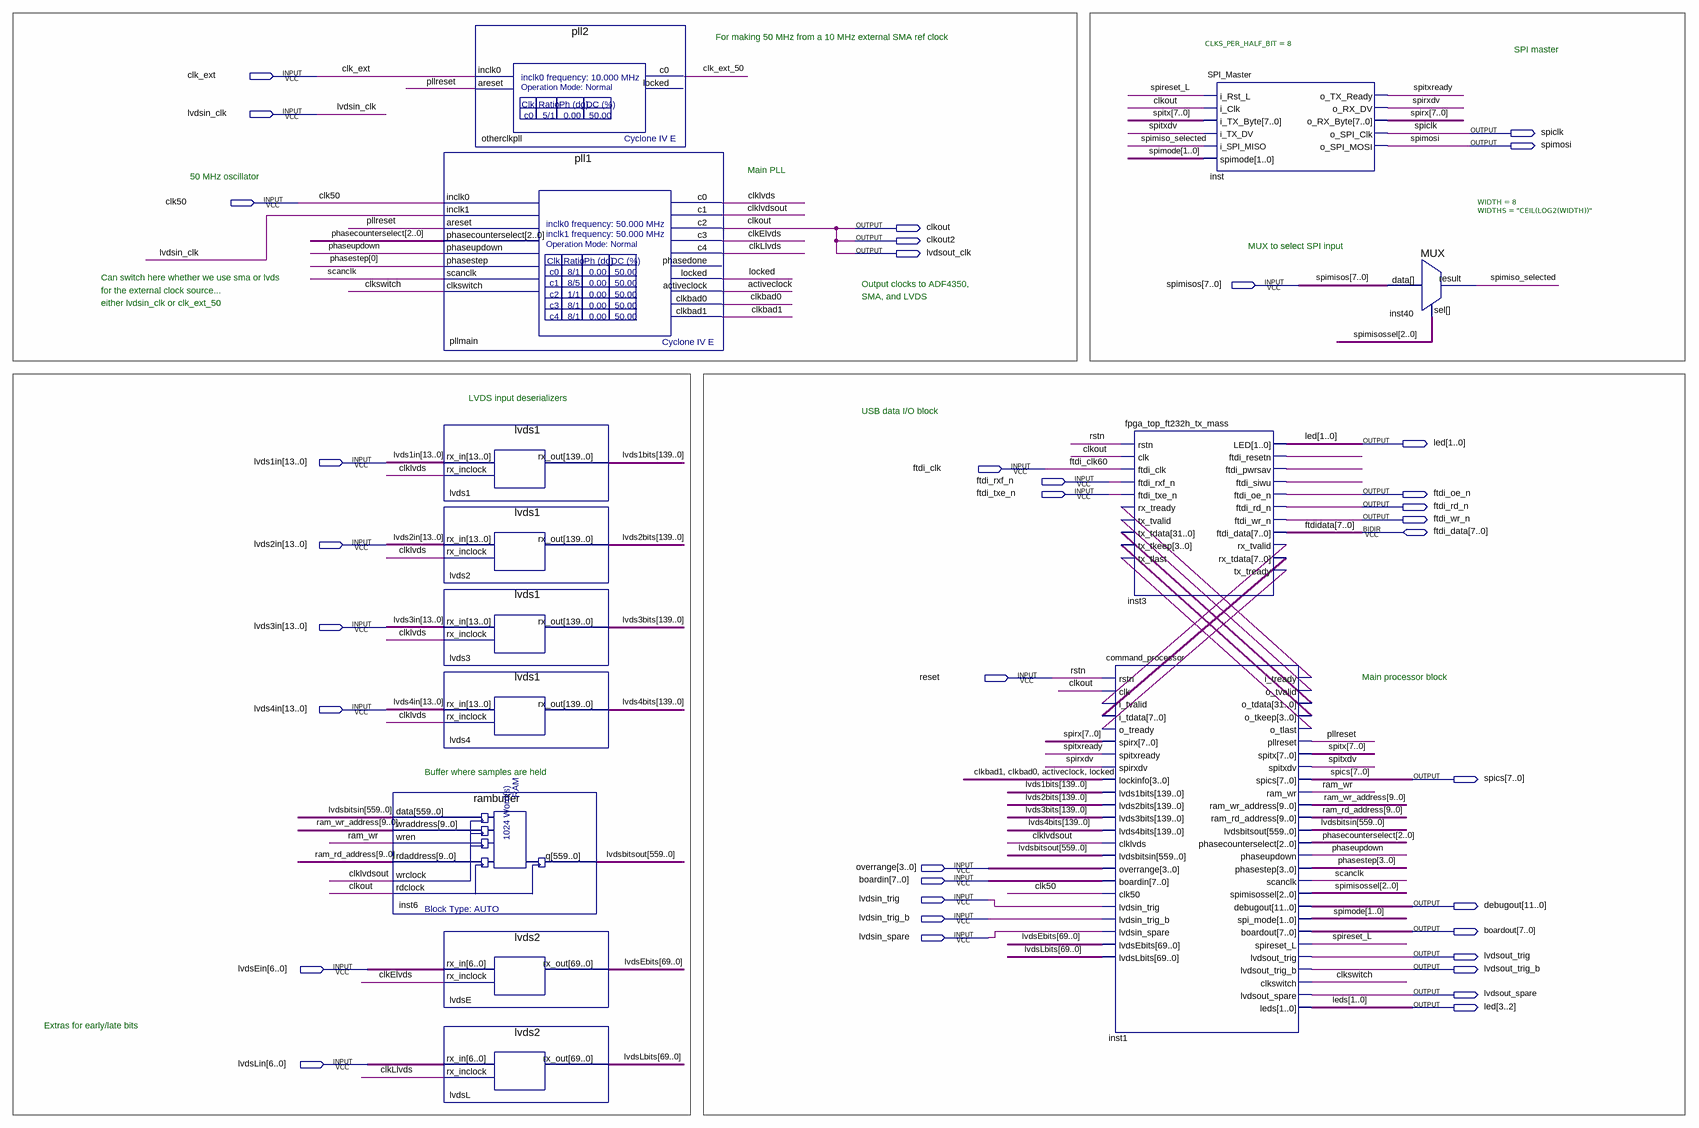
[diagram p0: schematic sheet]
// Quartus schematic coincidence.bdf as structural Verilog: 13 symbols, 36 pins
module coincidence (
  input  clk_ext,
  input  lvdsin_clk,
  input  clk50,
  input  [7:0] spimisos,
  input  [13:0] lvds1in,
  input  ftdi_clk,
  input  ftdi_rxf_n,
  input  ftdi_txe_n,
  input  [13:0] lvds2in,
  input  [13:0] lvds3in,
  input  reset,
  input  [13:0] lvds4in,
  input  [3:0] overrange,
  input  [7:0] boardin,
  input  lvdsin_trig,
  input  lvdsin_trig_b,
  input  lvdsin_spare,
  input  [6:0] lvdsEin,
  input  [6:0] lvdsLin,
  inout  [7:0] ftdi_data,
  output spiclk,
  output spimosi,
  output clkout,
  output clkout2,
  output lvdsout_clk,
  output [3:0] led,
  output ftdi_oe_n,
  output ftdi_rd_n,
  output ftdi_wr_n,
  output [7:0] spics,
  output [11:0] debugout,
  output [7:0] boardout,
  output lvdsout_trig,
  output lvdsout_trig_b,
  output lvdsout_spare
);

  wire activeclock, clk_ext_50, clkbad0, clkbad1, clkElvds, clkLlvds, clklvds, clklvdsout, clkswitch,
       inst1_i_tready, inst1_o_tlast, inst1_o_tvalid, inst3_ftdi_pwrsav, inst3_ftdi_resetn, inst3_ftdi_siwu,
       inst3_rx_tvalid, inst3_tx_tready, locked, phaseupdown, pllreset, ram_wr, scanclk, spimiso_selected,
       spireset_L, spirxdv, spitxdv, spitxready;
  wire [1:0] spimode;
  wire [2:0] phasecounterselect, spimisossel;
  wire [3:0] inst1_o_tkeep, phasestep;
  wire [7:0] inst3_rx_tdata, spirx, spitx;
  wire [9:0] ram_rd_address, ram_wr_address;
  wire [31:0] inst1_o_tdata;
  wire [69:0] lvdsEbits, lvdsLbits;
  wire [139:0] lvds1bits, lvds2bits, lvds3bits, lvds4bits;
  wire [559:0] lvdsbitsin, lvdsbitsout;

  rambuffer inst6 (
    .data(lvdsbitsin), .wraddress(ram_wr_address), .wren(ram_wr), .rdaddress(ram_rd_address),
    .wrclock(clklvdsout), .rdclock(clkout), .q(lvdsbitsout));
  pll2 otherclkpll (.inclk0(clk_ext), .areset(pllreset), .c0(clk_ext_50));  // open: locked
  pll1 pllmain (
    .inclk0(clk50), .inclk1(lvdsin_clk), .areset(pllreset), .phasecounterselect(phasecounterselect),
    .phaseupdown(phaseupdown), .phasestep(phasestep[0]), .scanclk(scanclk), .clkswitch(clkswitch),
    .c0(clklvds), .c1(clklvdsout), .c2(clkout), .c3(clkElvds), .c4(clkLlvds), .locked(locked),
    .activeclock(activeclock), .clkbad0(clkbad0), .clkbad1(clkbad1));  // open: phasedone
  lvds1 lvds1 (.rx_in(lvds1in), .rx_inclock(clklvds), .rx_out(lvds1bits));
  lvds1 lvds2 (.rx_in(lvds2in), .rx_inclock(clklvds), .rx_out(lvds2bits));
  lvds1 lvds3 (.rx_in(lvds3in), .rx_inclock(clklvds), .rx_out(lvds3bits));
  lvds1 lvds4 (.rx_in(lvds4in), .rx_inclock(clklvds), .rx_out(lvds4bits));
  lvds2 lvdsE (.rx_in(lvdsEin), .rx_inclock(clkElvds), .rx_out(lvdsEbits));
  lvds2 lvdsL (.rx_in(lvdsLin), .rx_inclock(clkLlvds), .rx_out(lvdsLbits));
  fpga_top_ft232h_tx_mass inst3 (
    .rstn(reset), .clk(clkout), .ftdi_clk(ftdi_clk), .ftdi_rxf_n(ftdi_rxf_n), .ftdi_txe_n(ftdi_txe_n),
    .rx_tready(inst1_i_tready), .tx_tvalid(inst1_o_tvalid), .tx_tdata(inst1_o_tdata),
    .tx_tkeep(inst1_o_tkeep), .tx_tlast(inst1_o_tlast), .LED(led[1:0]), .ftdi_resetn(inst3_ftdi_resetn),
    .ftdi_pwrsav(inst3_ftdi_pwrsav), .ftdi_siwu(inst3_ftdi_siwu), .ftdi_oe_n(ftdi_oe_n),
    .ftdi_rd_n(ftdi_rd_n), .ftdi_wr_n(ftdi_wr_n), .rx_tvalid(inst3_rx_tvalid), .rx_tdata(inst3_rx_tdata),
    .tx_tready(inst3_tx_tready), .ftdi_data(ftdi_data));
  command_processor inst1 (
    .rstn(reset), .clk(clkout), .i_tvalid(inst3_rx_tvalid), .i_tdata(inst3_rx_tdata),
    .o_tready(inst3_tx_tready), .spirx(spirx), .spitxready(spitxready), .spirxdv(spirxdv),
    .lockinfo({clkbad1, clkbad0, activeclock, locked}), .lvds1bits(lvds1bits), .lvds2bits(lvds2bits),
    .lvds3bits(lvds3bits), .lvds4bits(lvds4bits), .clklvds(clklvdsout), .lvdsbitsin(lvdsbitsout),
    .overrange(overrange), .boardin(boardin), .clk50(clk50), .lvdsin_trig(lvdsin_trig),
    .lvdsin_trig_b(lvdsin_trig_b), .lvdsin_spare(lvdsin_spare), .lvdsEbits(lvdsEbits), .lvdsLbits(lvdsLbits),
    .i_tready(inst1_i_tready), .o_tvalid(inst1_o_tvalid), .o_tdata(inst1_o_tdata), .o_tkeep(inst1_o_tkeep),
    .o_tlast(inst1_o_tlast), .pllreset(pllreset), .spitx(spitx), .spitxdv(spitxdv), .spics(spics),
    .ram_wr(ram_wr), .ram_wr_address(ram_wr_address), .ram_rd_address(ram_rd_address),
    .lvdsbitsout(lvdsbitsin), .phasecounterselect(phasecounterselect), .phaseupdown(phaseupdown),
    .phasestep(phasestep), .scanclk(scanclk), .spimisossel(spimisossel), .debugout(debugout),
    .spi_mode(spimode), .boardout(boardout), .spireset_L(spireset_L), .lvdsout_trig(lvdsout_trig),
    .lvdsout_trig_b(lvdsout_trig_b), .clkswitch(clkswitch), .lvdsout_spare(lvdsout_spare), .leds(led[3:2]));
  SPI_Master #(.CLKS_PER_HALF_BIT(8)) inst (
    .i_Rst_L(spireset_L), .i_Clk(clkout), .i_TX_Byte(spitx), .i_TX_DV(spitxdv),
    .i_SPI_MISO(spimiso_selected), .spimode(spimode), .o_TX_Ready(spitxready), .o_RX_DV(spirxdv),
    .o_RX_Byte(spirx), .o_SPI_Clk(spiclk), .o_SPI_MOSI(spimosi));
  MUX #(.WIDTH(8), .WIDTHS("CEIL(LOG2(WIDTH))")) inst40 (.data(spimisos), .sel(spimisossel), .result(spimiso_selected));

  assign clkout2 = clkout;
  assign lvdsout_clk = clkout;

  // Other names for the same wires on the sheet: ftdi_clk60 = ftdi_clk; ftdidata[7:0] = ftdi_data;
  //   leds[1:0] = led[3:2]; rstn = reset

  // Notes on the sheet:
  //   For making 50 MHz from a 10 MHz external SMA ref clock
  //   SPI master
  //   Main PLL
  //   50 MHz oscillator
  //   MUX to select SPI input
  //   Can switch here whether we use sma or lvds
  //   Output clocks to ADF4350,
  //   for the external clock source...
  //   SMA, and LVDS
  //   either lvdsin_clk or clk_ext_50
  //   LVDS input deserializers
  //   USB data I/O block
  //   Main processor block
  //   Buffer where samples are held
  //   Extras for early/late bits
endmodule
